# EAGLE design ESP12-breakout-pth-rev2 (EAGLE 7.5.0)
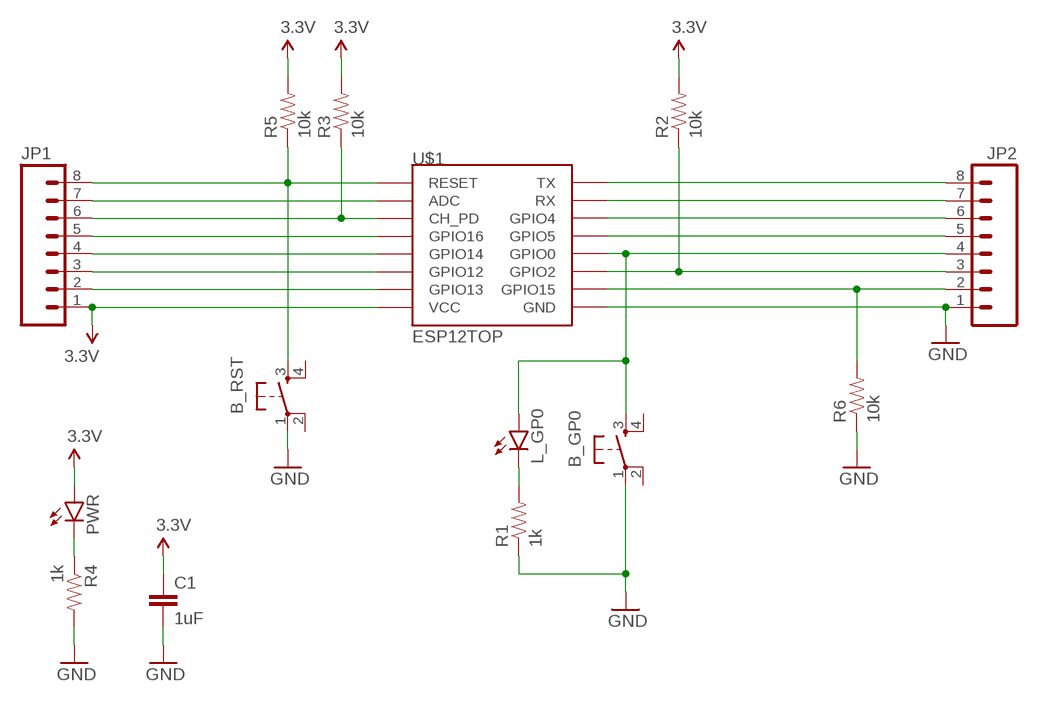
[diagram p0: schematic, sheet 1]

## Parts
B_GP0  TAC_SWITCHPTH  [TACTILE-PTH]
B_RST  TAC_SWITCHPTH  [TACTILE-PTH]
C1  1uF  CAPPTH  [CAP-PTH-SMALL]
JP1  M08  [1X08_PIN1_NO_SILK]
JP2  M08  [1X08_PIN1_NO_SILK]
L_GP0  LED3MM  [LED3MM]
PWR  LED3MM  [LED3MM]
R1  1k  RESISTORPTH-1/6W  [1/6W-RES]
R2  10k  RESISTORPTH-1/6W  [1/6W-RES]
R3  10k  RESISTORPTH-1/6W  [1/6W-RES]
R4  1k  RESISTORPTH-1/6W  [1/6W-RES]
R5  10k  RESISTORPTH-1/6W  [1/6W-RES]
R6  10k  RESISTORPTH-1/6W  [1/6W-RES]
U$1  ESP12TOP  [ESP12TOP]

## Nets
3.3V: C1.1 JP1.1 PWR.A R2.2 R3.2 R5.2 U$1.VCC
GND: B_GP0.1 B_RST.1 C1.2 JP2.1 R1.1 R4.2 R6.1 U$1.GND
N$1: L_GP0.K(C) R1.2
N$2: JP1.2 U$1.GPIO13
N$3: JP1.3 U$1.GPIO12
N$4: JP1.4 U$1.GPIO14
N$5: JP1.5 U$1.GPIO16
N$6: JP1.6 R3.1 U$1.CH_PD
N$7: JP1.7 U$1.ADC
N$8: B_RST.3 JP1.8 R5.1 U$1.RESET
N$9: PWR.K(C) R4.1
N$10: JP2.2 R6.2 U$1.GPIO15
N$11: JP2.3 R2.1 U$1.GPIO2
N$12: B_GP0.3 JP2.4 L_GP0.A U$1.GPIO0
N$13: JP2.5 U$1.GPIO5
N$14: JP2.6 U$1.GPIO4
N$15: JP2.7 U$1.RXD(RX)
N$16: JP2.8 U$1.TXD(TX)
Unconnected: B_GP0.2 B_GP0.4 B_RST.2 B_RST.4

## Library data of the parts
B_GP0 B_RST = SparkFun-Electromechanical:TAC_SWITCH: Momentary Switch Button commonly used for reset or general input. Spark Fun Electronics SKU : COM-00097 SMT- SWCH-08247
C1 = SparkFun-Capacitors:CAP: Capacitor Standard 0603 ceramic capacitor, and 0.1" leaded capacitor.
JP1 JP2 = SparkFun-Connectors:M08: Header 8 Standard 8-pin 0.1" header. Use with straight break away headers (SKU : PRT-00116), right angle break away headers (PRT-00553), swiss pins (PRT-00743), machine pins (PRT-00117), and female headers (PRT-00115).
L_GP0 PWR = SparkFun-LED:LED: LEDs Standard schematic elements and footprints for 5mm, 3mm, 1206, and 0603 sized LEDs. 5mm - Spark Fun Electronics SKU : COM-00529 (and others)
R1-R6 = SparkFun-Resistors:RESISTOR: Resistor Basic schematic elements and footprints for 0603, 1206, and PTH resistors.
U$1 = esp8266modules:ESP12: ESP8266 Wifi module 12

## Board
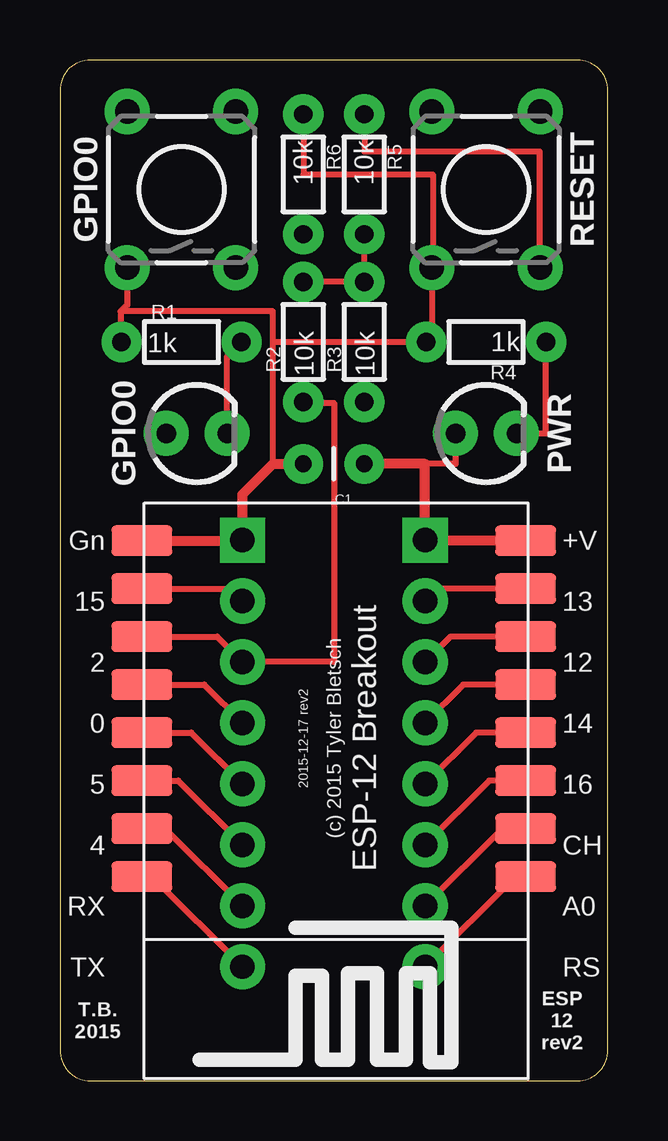
[diagram p1: board, top side]
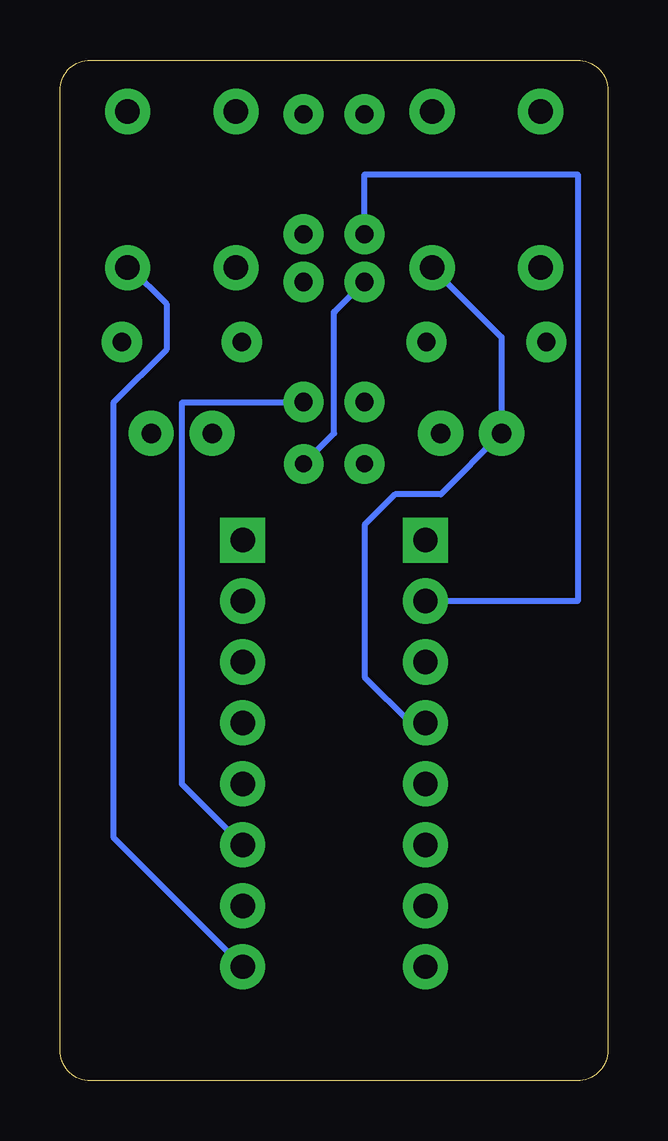
[diagram p2: board, bottom side, seen from below]

Size 22.85 x 42.54 mm. Coordinates in mm from the lower left corner, seen from the top.
Outline: 22.85,1.27 22.85,41.26 arc90 21.58,42.54 1.27,42.54 arc90 0,41.26 0,1.27 arc90 1.27,0 21.58,0 arc90 22.85,1.27
Copper layers (1*16): Top 0.0356mm / dielectric 1.5011mm / Bottom 0.0356mm
Design rules "OSH-Park-PCBOrder": minimum track width 6mil, minimum drill 13mil, track to track 6mil, track to pad 6mil, pad to pad 6mil, via to via 6mil, smd to smd 6mil, copper to edge 15mil, drill to drill 6mil, minimum pad ring 7mil, minimum via ring 7mil, stop-mask expansion 3mil, vias tented up to drill 0mil, thermal gap 10mil

### Footprints (pad centres in the part's own frame; a part is rotated, then mirrored left to right if it is on the bottom)
TACTILE-PTH = drill 1.016 pad 1.88: 1 -3.251,2.261; 2 3.251,2.261; 3 -3.251,-2.261; 4 3.251,-2.261
CAP-PTH-SMALL = drill 0.7 pad 1.651: 1 0,0; 2 2.54,0
1X08_PIN1_NO_SILK = drill 1.016 pad 1.88 square: 1 0,0 | drill 1.016 pad 1.88: 2 2.54,0; 3 5.08,0; 4 7.62,0; 5 10.16,0; 6 12.7,0; 7 15.24,0; 8 17.78,0
LED3MM = drill 0.813 pad 1.88: A -1.27,0; K 1.27,0
1/6W-RES = drill 0.762 pad 1.676: 1 -2.5,0; 2 2.5,0
ESP12TOP = smd 2.54 x 1.27: ADC -8,3.77; CH_PD -8,1.77; GND 8,-8.23; GPIO0 8,-2.23; GPIO2 8,-4.23; GPIO4 8,1.77; GPIO5 8,-0.23; GPIO12 -8,-4.23; GPIO13 -8,-6.23; GPIO14 -8,-2.23; GPIO15 8,-6.23; GPIO16 -8,-0.23; RESET -8,5.77; RXD 8,3.77; TXD 8,5.77; VCC -8,-8.23

### Placement (x,y rotation side)
B_GP0  5.07,37.14 90 top
B_RST  17.77,37.14 90 top
C1  12.69,25.71 180 top
JP1  15.23,22.53 270 top
JP2  7.61,22.53 270 top
L_GP0  5.7,26.98 0 top
PWR  17.77,26.98 0 top
R1  5.07,30.79 0 top
R2  10.15,30.79 90 top
R3  12.69,30.79 90 top
R4  17.77,30.79 180 top
R5  12.69,37.77 270 top
R6  10.15,37.77 270 top
U$1  11.42,14.28 180 top

### Tracks (layer width: path | path; a pad name or v marks a point on that pad's centre or on a via)
3.3V
  Top 0.254: PWR.A 16.5,25.71 15.23,25.71 | R2.2 R3.2 R5.2
  Top 0.406: U$1.VCC 15.25,22.51 JP1.1 15.23,25.71 C1.1
  Bottom 0.254: C1.1 11.42,26.98 11.42,32.06 11.38,32.06 R2.2
GND
  Top 0.254: 8.88,25.71 8.88,30.79 | 8.88,30.79 R4.2 15.51,31.03 B_RST.1 15.55,33.92 15.55,37.77 10.15,37.77 R6.1 | 8.88,30.79 8.88,32.06 2.53,32.06 | 2.53,32.06 2.53,30.83 R1.1 | B_GP0.1 2.81,32.34 2.53,32.06
  Top 0.406: U$1.GND 7.58,22.51 JP2.1 7.61,24.44 8.88,25.71 C1.2
N$1
  Top 0.254: L_GP0.K 6.97,30.19 R1.2
N$2
  Top 0.254: U$1.GPIO13 15.74,20.51 JP1.2
N$3
  Top 0.254: U$1.GPIO12 16.28,18.51 JP1.3
N$4
  Top 0.254: U$1.GPIO14 16.82,16.51 JP1.4
N$5
  Top 0.254: U$1.GPIO16 17.36,14.51 JP1.5
N$6
  Top 0.254: U$1.CH_PD 17.9,12.51 JP1.6
  Bottom 0.254: R3.1 12.69,28.25 17.77,28.25 17.77,12.37 JP1.6
N$7
  Top 0.254: U$1.ADC 18.44,10.51 JP1.7
N$8
  Top 0.254: U$1.RESET 18.98,8.51 JP1.8 | R5.1 12.69,38.73 19.99,38.73 19.99,33.89 B_RST.3
  Bottom 0.254: B_RST.3 19.91,33.89 18.4,32.37 18.4,30.47 20.62,28.25 20.62,10.15 JP1.8
N$9
  Top 0.254: PWR.K 20.27,26.98 R4.1
N$10
  Top 0.254: U$1.GPIO15 7.09,20.51 JP2.2
  Bottom 0.254: R6.2 10.15,37.77 1.26,37.77 1.26,19.99 JP2.2
N$11
  Top 0.254: U$1.GPIO2 6.55,18.51 JP2.3 11.42,17.45 11.42,28.25 10.15,28.25 R2.1
N$12
  Top 0.254: U$1.GPIO0 6.01,16.51 JP2.4
  Bottom 0.254: B_GP0.3 4.43,30.99 L_GP0.A 6.97,24.44 8.88,24.44 10.15,23.17 10.15,16.82 8.24,14.91 JP2.4
N$13
  Top 0.254: U$1.GPIO5 5.47,14.51 JP2.5
N$14
  Top 0.254: U$1.GPIO4 4.93,12.51 JP2.6
N$15
  Top 0.254: U$1.RXD 4.39,10.51 JP2.7
N$16
  Top 0.254: U$1.TXD 3.85,8.51 JP2.8

### Text on the board
tPlace: GPIO0 | RESET | GPIO0 | PWR | Gn | +V | 15 | 13 | 2 | 12 | 0 | 14 | 2015-12-17 rev2 | (c) 2015 Tyler Bletsch | ESP-12 Breakout | 5 | 16 | 4 | CH | RX | A0 | TX | RS | T.B. / 2015 | ESP / 12 / rev2